# EAGLE schematic BikeLapse_Camera_Trigger_V3_Schematic_v12 (EAGLE 9.7.0)
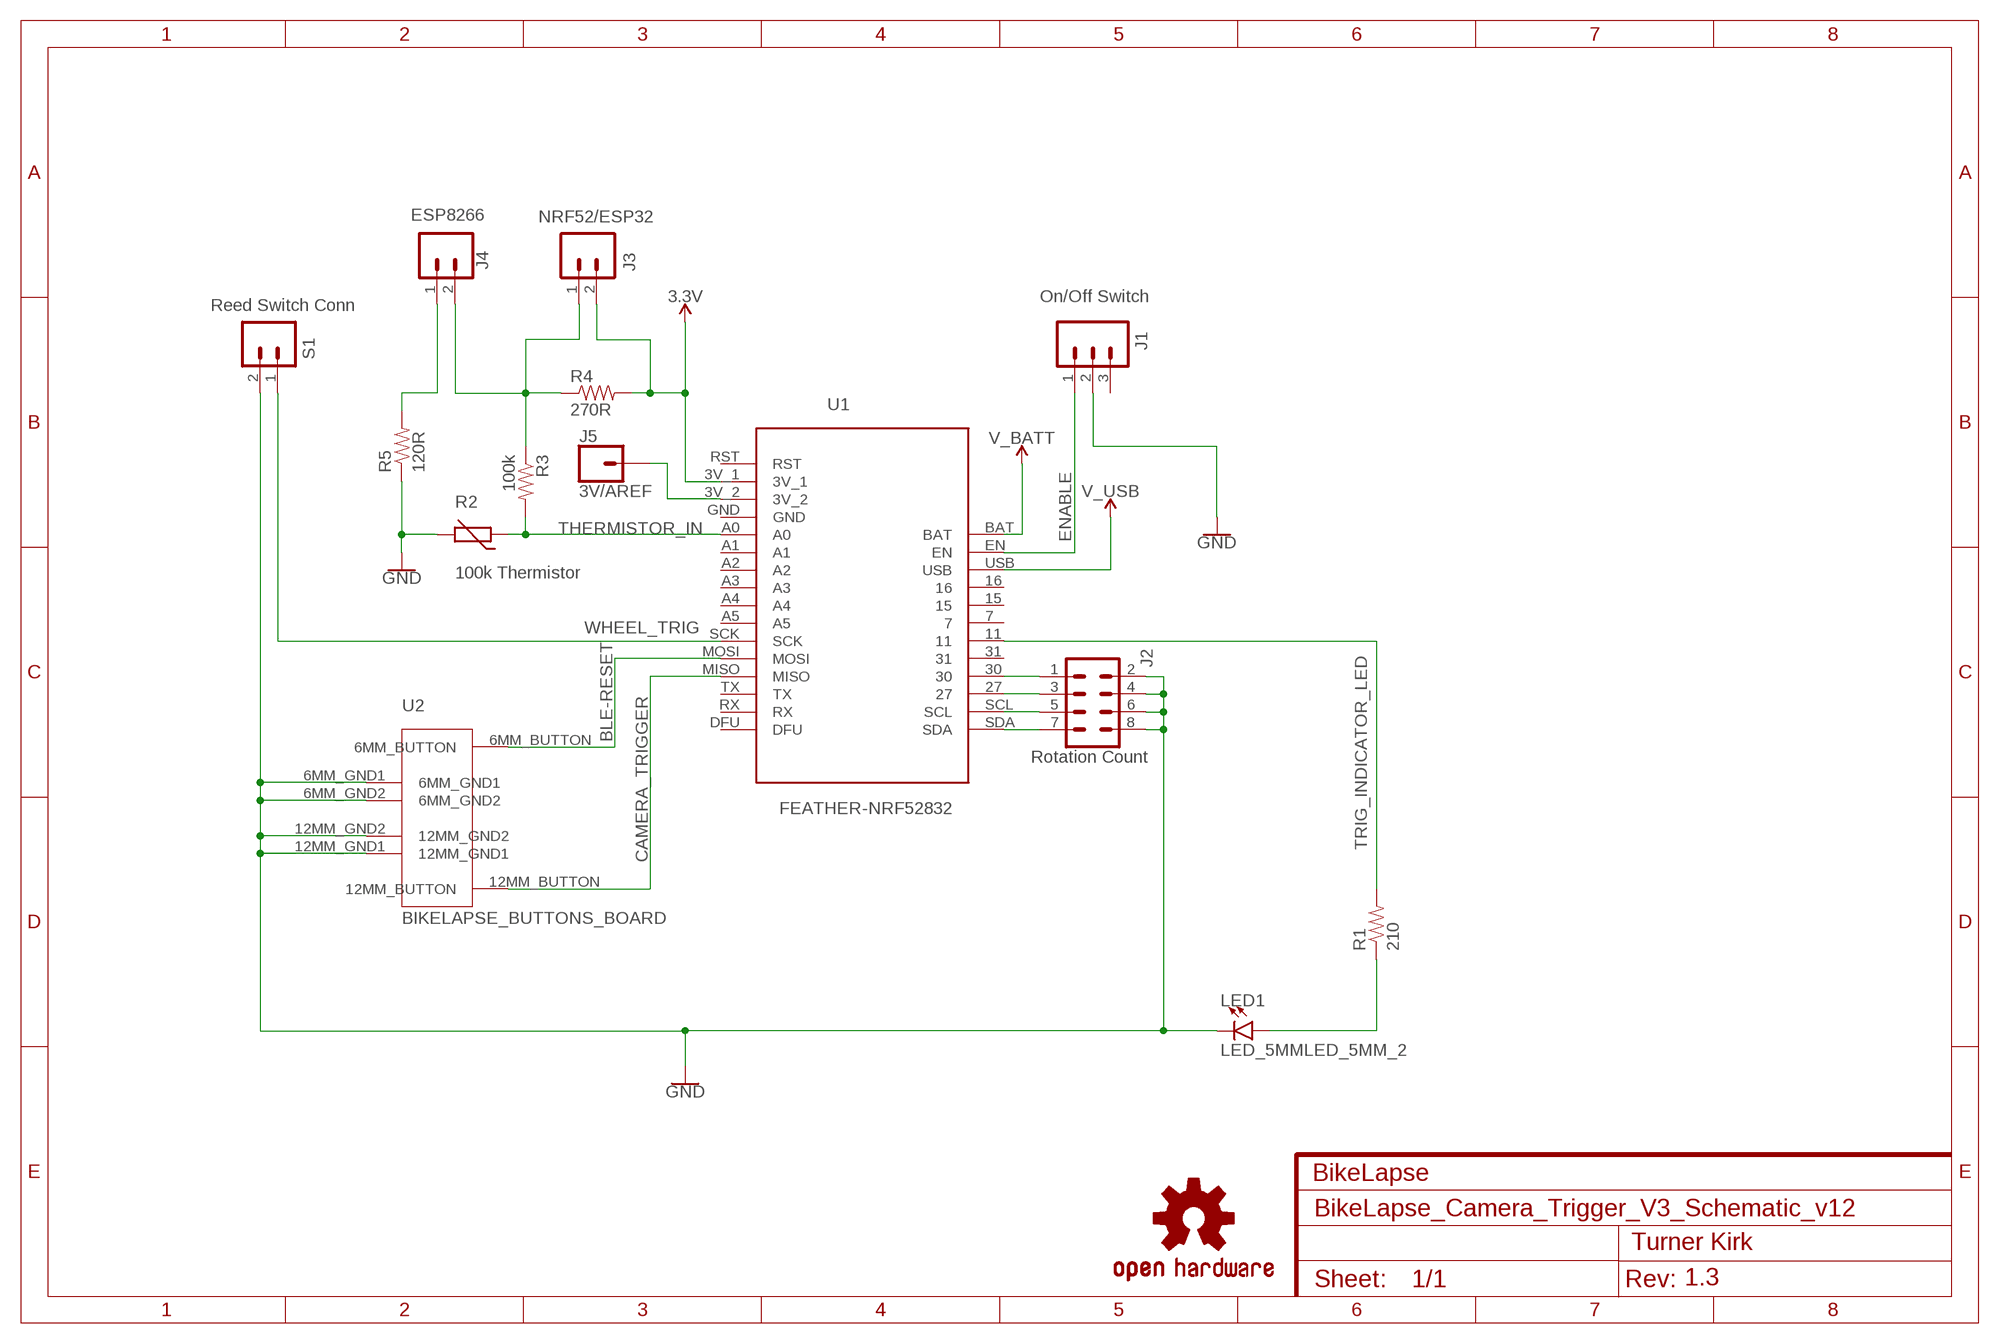
[diagram p0: schematic, sheet 1]
FRAME1 (FRAME-A4L): CNAME: BikeLapse; CREVISION: 1.3; DESIGNER: Turner Kirk

## Parts
J1  On/Off Switch  CONN_03RA-PTH  [1X03_RA_PTH]
J2  Rotation Count  CONN_04X2  [2X4]
J3  NRF52/ESP32  CONN_02  [1X02]
J4  ESP8266  CONN_02  [1X02]
J5  3V/AREF  CONN_01  [1X01]
LED1  LED_5MMLED_5MM_2  [LEDRD254W60D565H860B]
LOGO1  OSHW-LOGOL  [OSHW-LOGO-L]
R1  210  SPARKFUN-RESISTORSPTH-1/4W  [SPARKFUN-RESISTORS_AXIAL-0.4]
R2  100k Thermistor  THERMISTOR  [RS-2,5-SINGLE_PIN]
R3  100k  SPARKFUN-RESISTORSPTH-1/4W  [SPARKFUN-RESISTORS_AXIAL-0.4]
R4  270R  SPARKFUN-RESISTORSPTH-1/4W  [SPARKFUN-RESISTORS_AXIAL-0.4]
R5  120R  SPARKFUN-RESISTORSPTH-1/4W  [SPARKFUN-RESISTORS_AXIAL-0.4]
S1  Reed Switch Conn  CONN_021X02_RA_PTH  [1X02_RA_PTH]
U1  FEATHER-NRF52832  [FEATHER-NRF52832]
U2  BIKELAPSE_BUTTONS_BOARD  [BIKELAPSE_BUTTONS_BOARD]

## Nets
3.3V: J3.2 R4.P$2 U1.3V_1
BLE-RESET: U1.MOSI U2.6MM_BUTTON
CAMERA_TRIGGER: U1.MISO U2.12MM_BUTTON
ENABLE: J1.1 U1.EN
GND: J1.2 J2.2 J2.4 J2.6 J2.8 LED1.K(C) R2.2 R5.P$1 S1.2 U2.6MM_GND1 U2.6MM_GND2 U2.12MM_GND1 U2.12MM_GND2
N$1: J2.3 U1.27
N$2: J2.1 U1.30
N$3: J2.5 U1.SCL
N$4: J2.7 U1.SDA
N$5: J5.1 U1.3V_2
N$6: J4.1 R5.P$2
N$7: J3.1 J4.2 R3.P$1 R4.P$1
N$11: LED1.A R1.P$1
THERMISTOR_IN: R2.1 R3.P$2 U1.A0
TRIG_INDICATOR_LED: R1.P$2 U1.11
V_BATT: U1.BAT
V_USB: U1.USB
WHEEL_TRIG: S1.1 U1.SCK
Unconnected: J1.3 U1.7 U1.15 U1.16 U1.31 U1.A1 U1.A2 U1.A3 U1.A4 U1.A5 U1.DFU U1.RST U1.RX U1.TX

## Power pins joined to a net without a drawn wire
GND: U1.GND

## Library data of the parts
J1 = Distance_Lapse_Camera_Trigger:CONN_03: Multi connection point. Often used as Generic Header-pin footprint for 0.1 inch spaced/style header connections On any of the 0.1 inch spaced packages, you can populate with these: Break Away Headers - Straight <https://www.sparkfun.com/products/116> (PRT-00116) Break Away Male Headers - Right Angle <https://www.sparkfun.com/products/553> (PRT-00553) Female Headers <https://www.sparkfun.com/products/115> (PRT-00115) Break Away Headers - Machine Pin <https://www.sparkfun.com/products/117> (PRT-00117) Break Away Female Headers - Swiss Machine Pin <https://www.sparkfun.com/products/743> (PRT-00743) Stackable Header - 3 Pin (Female, 0.1") <https://www.sparkfun.com/products/13875> (PRT-13875) For SCREWTERMINALS and SPRING TERMINALS visit here: Screw Terimnals on SparkFun.com <https://www.sparkfun.com/search/results?term=Screw+Terminals> (5mm/3.5mm/2.54mm spacing) This device is also useful as a general connection point to wire up your design to another part of your project. Our various solder wires solder well into these plated through hole pads. Hook-Up Wire - Assortment (Stranded, 22 AWG) <https://www.sparkfun.com/products/11375> (PRT-11375) Hook-Up Wire - Assortment (Solid Core, 22 AWG) <https://www.sparkfun.com/products/11367> (PRT-11367) View the entire wire category on our website here <https://www.sparkfun.com/categories/141> Special notes: Molex polarized connector foot print use with SKU : PRT-08232 with associated crimp pins and housings.
J2 = Distance_Lapse_Camera_Trigger:CONN_04X2: Multi connection point. Often used as Generic Header-pin footprint for 0.1 inch spaced/style header connections On any of the 0.1 inch spaced packages, you can populate with these: Break Away Headers - Straight <https://www.sparkfun.com/products/116> (PRT-00116) Break Away Male Headers - Right Angle <https://www.sparkfun.com/products/553> (PRT-00553) Female Headers <https://www.sparkfun.com/products/115> (PRT-00115) Break Away Headers - Machine Pin <https://www.sparkfun.com/products/117> (PRT-00117) Break Away Female Headers - Swiss Machine Pin <https://www.sparkfun.com/products/743> (PRT-00743)
J3 J4 S1 = Distance_Lapse_Camera_Trigger:CONN_02: Multi connection point. Often used as Generic Header-pin footprint for 0.1 inch spaced/style header connections On any of the 0.1 inch spaced packages, you can populate with these: Break Away Headers - Straight <https://www.sparkfun.com/products/116> (PRT-00116) Break Away Male Headers - Right Angle <https://www.sparkfun.com/products/553> (PRT-00553) Female Headers <https://www.sparkfun.com/products/115> (PRT-00115) Break Away Headers - Machine Pin <https://www.sparkfun.com/products/117> (PRT-00117) Break Away Female Headers - Swiss Machine Pin <https://www.sparkfun.com/products/743> (PRT-00743) For SCREWTERMINALS and SPRING TERMINALS visit here: Screw Terimnals on SparkFun.com <https://www.sparkfun.com/search/results?term=Screw+Terminals> (5mm/3.5mm/2.54mm spacing) This device is also useful as a general connection point to wire up your design to another part of your project. Our various solder wires solder well into these plated through hole pads. Hook-Up Wire - Assortment (Stranded, 22 AWG) <https://www.sparkfun.com/products/11375> (PRT-11375) Hook-Up Wire - Assortment (Solid Core, 22 AWG) <https://www.sparkfun.com/products/11367> (PRT-11367) View the entire wire category on our website here <https://www.sparkfun.com/categories/141> Special notes: Molex polarized connector foot print use with: PRT-08233 with associated crimp pins and housings. 2.54_SCREWTERM for use with PRT-10571. 3.5mm Screw Terminal footprints for PRT-08084 5mm Screw Terminal footprints for use with PRT-08432
J5 = Distance_Lapse_Camera_Trigger:CONN_01: Single connection point. Often used as Generic Header-pin footprint for 0.1 inch spaced/style header connections On any of the 0.1 inch spaced packages, you can populate with these: Break Away Headers - Straight <https://www.sparkfun.com/products/116> (PRT-00116) Break Away Male Headers - Right Angle <https://www.sparkfun.com/products/553> (PRT-00553) Female Headers <https://www.sparkfun.com/products/115> (PRT-00115) Break Away Headers - Machine Pin <https://www.sparkfun.com/products/117> (PRT-00117) Break Away Female Headers - Swiss Machine Pin <https://www.sparkfun.com/products/743> (PRT-00743) This device is also useful as a general connection point to wire up your design to another part of your project. Our various solder wires solder well into these plated through hole pads. Hook-Up Wire - Assortment (Stranded, 22 AWG) <https://www.sparkfun.com/products/11375> (PRT-11375) Hook-Up Wire - Assortment (Solid Core, 22 AWG) <https://www.sparkfun.com/products/11367> (PRT-11367) View the entire wire category on our website here <https://www.sparkfun.com/categories/141> Special notes: SMTSO-256-ET is a "flush mount" nut for a 4-40 screw. We mostly use this on specialty testbeds; it is a nice way to connect hardware to your PCB at an adjustable hieght. Also note, the SNAP packages are for using a snappable style connector. We sell a baggie of snaps and they are also used on two LilyPad designs: Snap Assortment - 30 pack (male and female) <https://www.sparkfun.com/products/11347> (DEV-11347) LilyPad Arduino SimpleSnap <https://www.sparkfun.com/products/10941> (DEV-10941) LilyPad SimpleSnap Protoboard <https://www.sparkfun.com/products/10940> (DEV-10940)
LED1 = Distance_Lapse_Camera_Trigger:LED_5MM
LOGO1 = Distance_Lapse_Camera_Trigger:OSHW-LOGO: Open-Source Hardware (OSHW) Logo This logo indicates the piece of hardware it is found on incorporates a OSHW license and/or adheres to the definition of open source hardware found here: http://freedomdefined.org/OSHW
R1 R3-R5 = Distance_Lapse_Camera_Trigger:SPARKFUN-RESISTORS: Resistor Basic schematic elements and footprints for 0603, 1206, and PTH resistors.
R2 = Distance_Lapse_Camera_Trigger:THERMISTOR: THERMISTOR
U1 = Distance_Lapse_Camera_Trigger:FEATHER-NRF52832
U2 = Turners Ultimate ECAD Library:BIKELAPSE_BUTTONS_BOARD